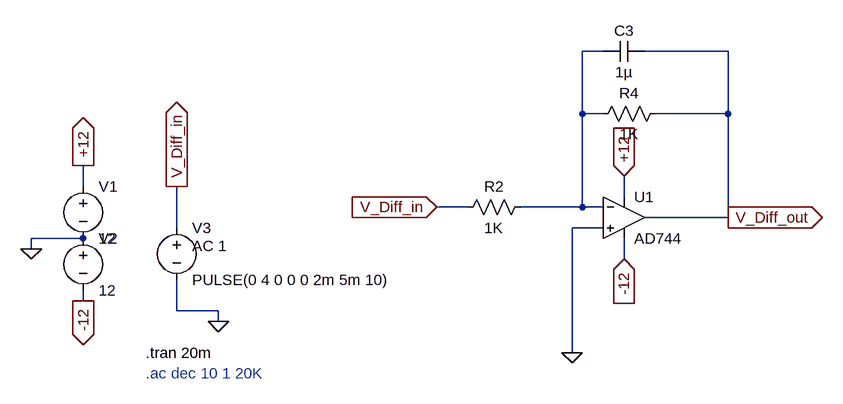
[diagram p0: schematic Iintegrator.asc]
Iintegrator.asc, the LTspice schematic file:
Version 4.1
SHEET 1 880 680
WIRE 112 -624 80 -624
WIRE 304 -624 176 -624
WIRE 80 -528 80 -624
WIRE 112 -528 80 -528
WIRE 304 -528 304 -624
WIRE 304 -528 192 -528
WIRE -688 -416 -688 -448
WIRE 144 -400 144 -432
WIRE -96 -384 -144 -384
WIRE 80 -384 80 -528
WIRE 80 -384 -16 -384
WIRE 112 -384 80 -384
WIRE 304 -368 304 -528
WIRE 304 -368 176 -368
WIRE -544 -352 -544 -416
WIRE 112 -352 64 -352
WIRE -688 -336 -768 -336
WIRE -768 -320 -768 -336
WIRE 144 -304 144 -336
WIRE -688 -240 -688 -256
WIRE -544 -224 -544 -272
WIRE -480 -224 -544 -224
WIRE -480 -208 -480 -224
WIRE 64 -160 64 -352
FLAG -144 -384 V_Diff_in
IOPIN -144 -384 In
FLAG 304 -368 V_Diff_out
IOPIN 304 -368 Out
FLAG -768 -320 0
FLAG -480 -208 0
FLAG -544 -416 V_Diff_in
IOPIN -544 -416 Out
FLAG -688 -448 +12
IOPIN -688 -448 Out
FLAG 144 -432 +12
IOPIN 144 -432 In
FLAG -688 -240 -12
IOPIN -688 -240 Out
FLAG 144 -304 -12
IOPIN 144 -304 In
FLAG 64 -160 0
SYMBOL OpAmps\\AD744 144 -432 R0
SYMATTR InstName U1
SYMBOL res 0 -400 R90
WINDOW 0 0 56 VBottom 2
WINDOW 3 32 56 VTop 2
SYMATTR InstName R2
SYMATTR Value 1K
SYMATTR SpiceLine tol=1 pwr=0.1
SYMBOL res 208 -544 R90
WINDOW 0 0 56 VBottom 2
WINDOW 3 32 56 VTop 2
SYMATTR InstName R4
SYMATTR Value 1K
SYMATTR SpiceLine tol=1 pwr=0.1
SYMBOL voltage -688 -432 R0
WINDOW 123 0 0 Left 0
WINDOW 39 0 0 Left 0
SYMATTR InstName V1
SYMATTR Value 12
SYMBOL voltage -688 -352 R0
WINDOW 123 0 0 Left 0
WINDOW 39 0 0 Left 0
SYMATTR InstName V2
SYMATTR Value 12
SYMBOL voltage -544 -368 R0
WINDOW 123 24 44 Left 2
WINDOW 39 0 0 Left 0
SYMATTR Value2 AC 1
SYMATTR InstName V3
SYMATTR Value PULSE(0 4 0 0 0 2m 5m 10)
SYMBOL cap 176 -640 R90
WINDOW 0 0 32 VBottom 2
WINDOW 3 32 32 VTop 2
SYMATTR InstName C3
SYMATTR Value 1µ
TEXT -592 -160 Left 2 !.tran 20m
TEXT -592 -128 Left 2 ;.ac dec 10 1 20K

The netlist it stands for:
* Iintegrator.asc
X§U1 0 N001 +12 -12 V_Diff_out AD744  ; pins In+ In- V+ V- OUT
R2 N001 V_Diff_in 1K tol=1 pwr=0.1
R4 V_Diff_out N001 1K tol=1 pwr=0.1
V1 +12 0 12
V2 0 -12 12
V3 V_Diff_in 0 PULSE(0 4 0 0 0 2m 5m 10) AC 1
C3 V_Diff_out N001 1µ
.tran 20m
* .ac dec 10 1 20K
.backanno
.end